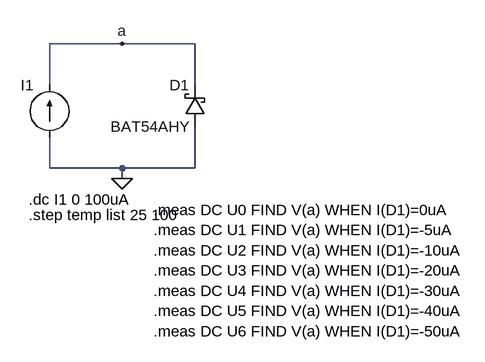
[diagram p0: schematic Diode-VI-meas-schottky-R.asc]
Diode-VI-meas-schottky-R.asc, the LTspice schematic file:
Version 4
SHEET 1 880 680
WIRE 48 160 -64 160
WIRE 160 160 48 160
WIRE -64 224 -64 160
WIRE 160 224 160 160
WIRE -64 352 -64 304
WIRE 48 352 -64 352
WIRE 160 352 160 288
WIRE 160 352 48 352
WIRE 48 368 48 352
FLAG 48 368 0
FLAG 48 160 a
SYMBOL schottky 176 288 R180
WINDOW 0 24 64 Left 2
WINDOW 3 24 0 Left 2
SYMATTR InstName D1
SYMATTR Value BAT54AHY
SYMATTR Description Diode
SYMATTR Type diode
SYMBOL current -64 304 R180
WINDOW 0 24 80 Left 2
WINDOW 3 24 0 Invisible 2
WINDOW 123 0 0 Left 2
WINDOW 39 0 0 Left 2
SYMATTR InstName I1
SYMATTR Value 0
TEXT -96 400 Left 2 !.dc I1 0 100uA
TEXT -96 424 Left 2 !.step temp list 25 100
TEXT 96 416 Left 2 !.meas DC U0 FIND V(a) WHEN I(D1)=0uA\n.meas DC U1 FIND V(a) WHEN I(D1)=-5uA\n.meas DC U2 FIND V(a) WHEN I(D1)=-10uA\n.meas DC U3 FIND V(a) WHEN I(D1)=-20uA\n.meas DC U4 FIND V(a) WHEN I(D1)=-30uA\n.meas DC U5 FIND V(a) WHEN I(D1)=-40uA\n.meas DC U6 FIND V(a) WHEN I(D1)=-50uA

The netlist it stands for:
* Diode-VI-meas-schottky-R.asc
D1 0 a BAT54AHY
I1 0 a 0
.model D D
.lib standard.dio
.dc I1 0 100uA
.step temp list 25 100
.meas DC U0 FIND V(a) WHEN I(D1)=0uA
.meas DC U1 FIND V(a) WHEN I(D1)=-5uA
.meas DC U2 FIND V(a) WHEN I(D1)=-10uA
.meas DC U3 FIND V(a) WHEN I(D1)=-20uA
.meas DC U4 FIND V(a) WHEN I(D1)=-30uA
.meas DC U5 FIND V(a) WHEN I(D1)=-40uA
.meas DC U6 FIND V(a) WHEN I(D1)=-50uA
.backanno
.end